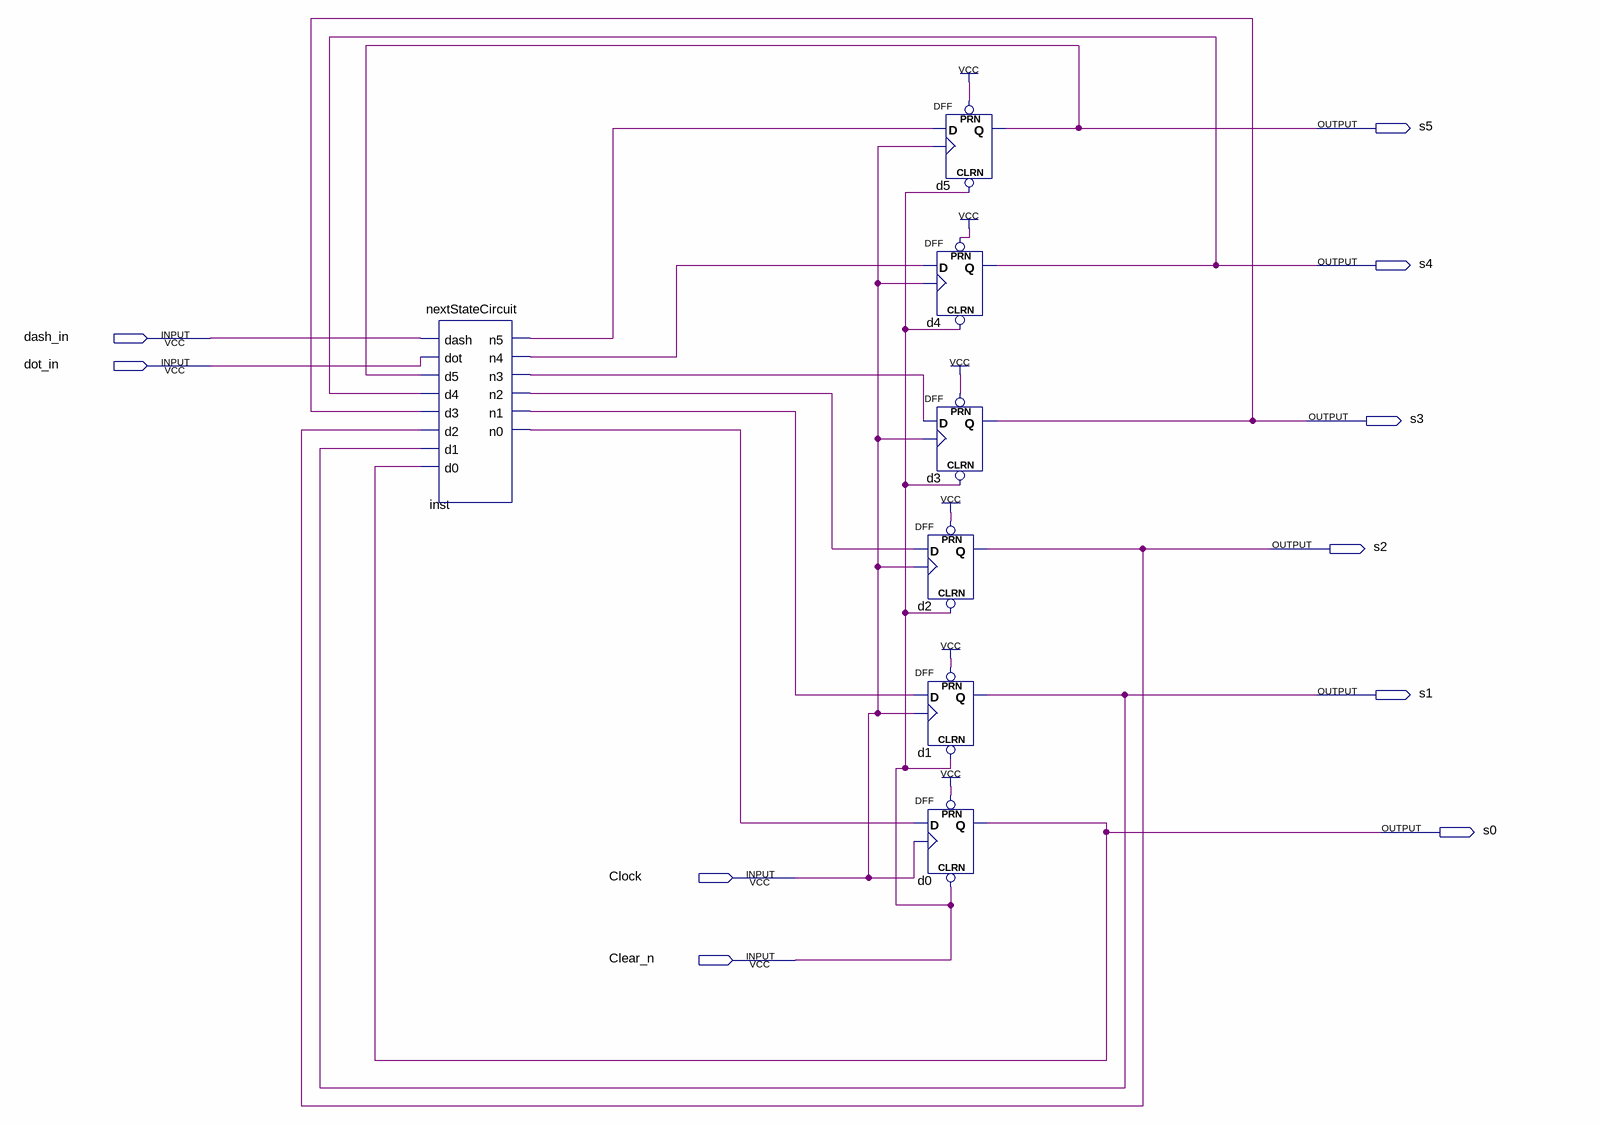
[diagram p0: schematic sheet]
// Quartus schematic CharFiniteStateMachine.bdf as structural Verilog: 7 symbols, 10 pins
module CharFiniteStateMachine (
  input  dash_in,
  input  dot_in,
  input  Clock,
  input  Clear_n,
  output s5,
  output s4,
  output s3,
  output s2,
  output s1,
  output s0
);

  wire inst_n0, inst_n1, inst_n2, inst_n3, inst_n4, inst_n5;

  nextStateCircuit inst (
    .dash(dash_in), .dot(dot_in), .d5(s5), .d4(s4), .d3(s3), .d2(s2), .d1(s1), .d0(s0), .n5(inst_n5),
    .n4(inst_n4), .n3(inst_n3), .n2(inst_n2), .n1(inst_n1), .n0(inst_n0));
  DFF d2 (.CLRN(Clear_n), .CLK(Clock), .D(inst_n2), .PRN(1'b1), .Q(s2));
  DFF d1 (.CLRN(Clear_n), .CLK(Clock), .D(inst_n1), .PRN(1'b1), .Q(s1));
  DFF d0 (.CLRN(Clear_n), .CLK(Clock), .D(inst_n0), .PRN(1'b1), .Q(s0));
  DFF d5 (.CLRN(Clear_n), .CLK(Clock), .D(inst_n5), .PRN(1'b1), .Q(s5));
  DFF d4 (.CLRN(Clear_n), .CLK(Clock), .D(inst_n4), .PRN(1'b1), .Q(s4));
  DFF d3 (.CLRN(Clear_n), .CLK(Clock), .D(inst_n3), .PRN(1'b1), .Q(s3));
endmodule
